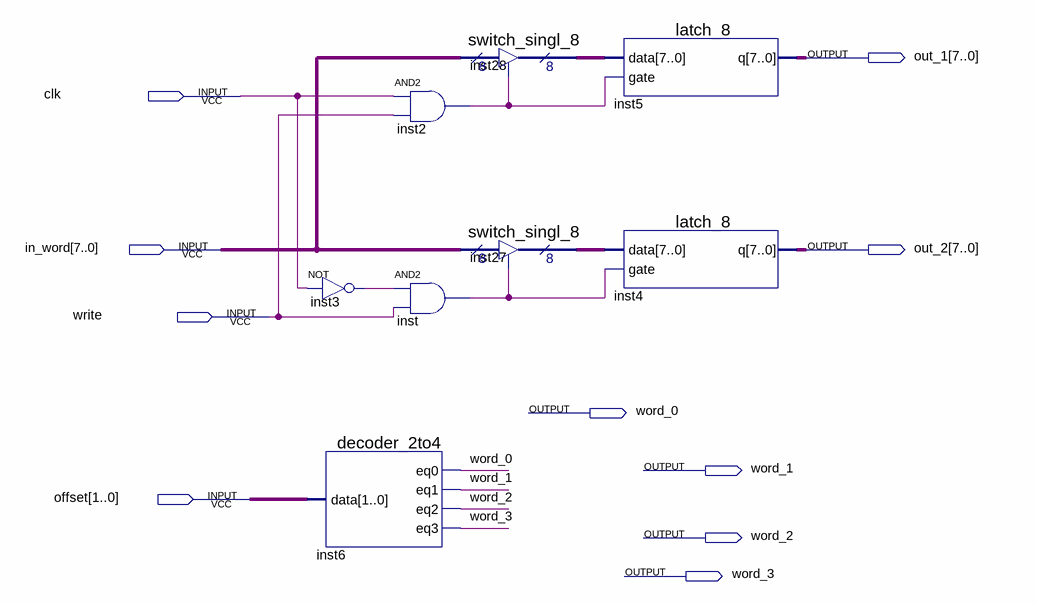
[diagram p0: schematic sheet]
// Quartus schematic __latch_test.bdf as structural Verilog: 8 symbols, 10 pins
module __latch_test (
  input  clk,
  input  [7:0] in_word,
  input  write,
  input  [1:0] offset,
  output [7:0] out_1,
  output [7:0] out_2,
  output word_0,
  output word_1,
  output word_2,
  output word_3
);

  wire inst2_out, inst3_out, inst_out;
  wire [7:0] inst27_tridata, inst28_tridata;

  not inst3 (inst3_out, clk);
  decoder_2to4 inst6 (.data(offset), .eq0(word_0), .eq1(word_1), .eq2(word_2), .eq3(word_3));
  and inst2 (inst2_out, clk, write);
  and inst (inst_out, inst3_out, write);
  switch_singl_8 inst28 (.enabledt(inst2_out), .data(in_word), .tridata(inst28_tridata));
  switch_singl_8 inst27 (.enabledt(inst_out), .data(in_word), .tridata(inst27_tridata));
  latch_8 inst5 (.data(inst28_tridata), .gate(inst2_out), .q(out_1));
  latch_8 inst4 (.data(inst27_tridata), .gate(inst_out), .q(out_2));
endmodule
